# EAGLE design Display_V1_1 (EAGLE 7.7.0)
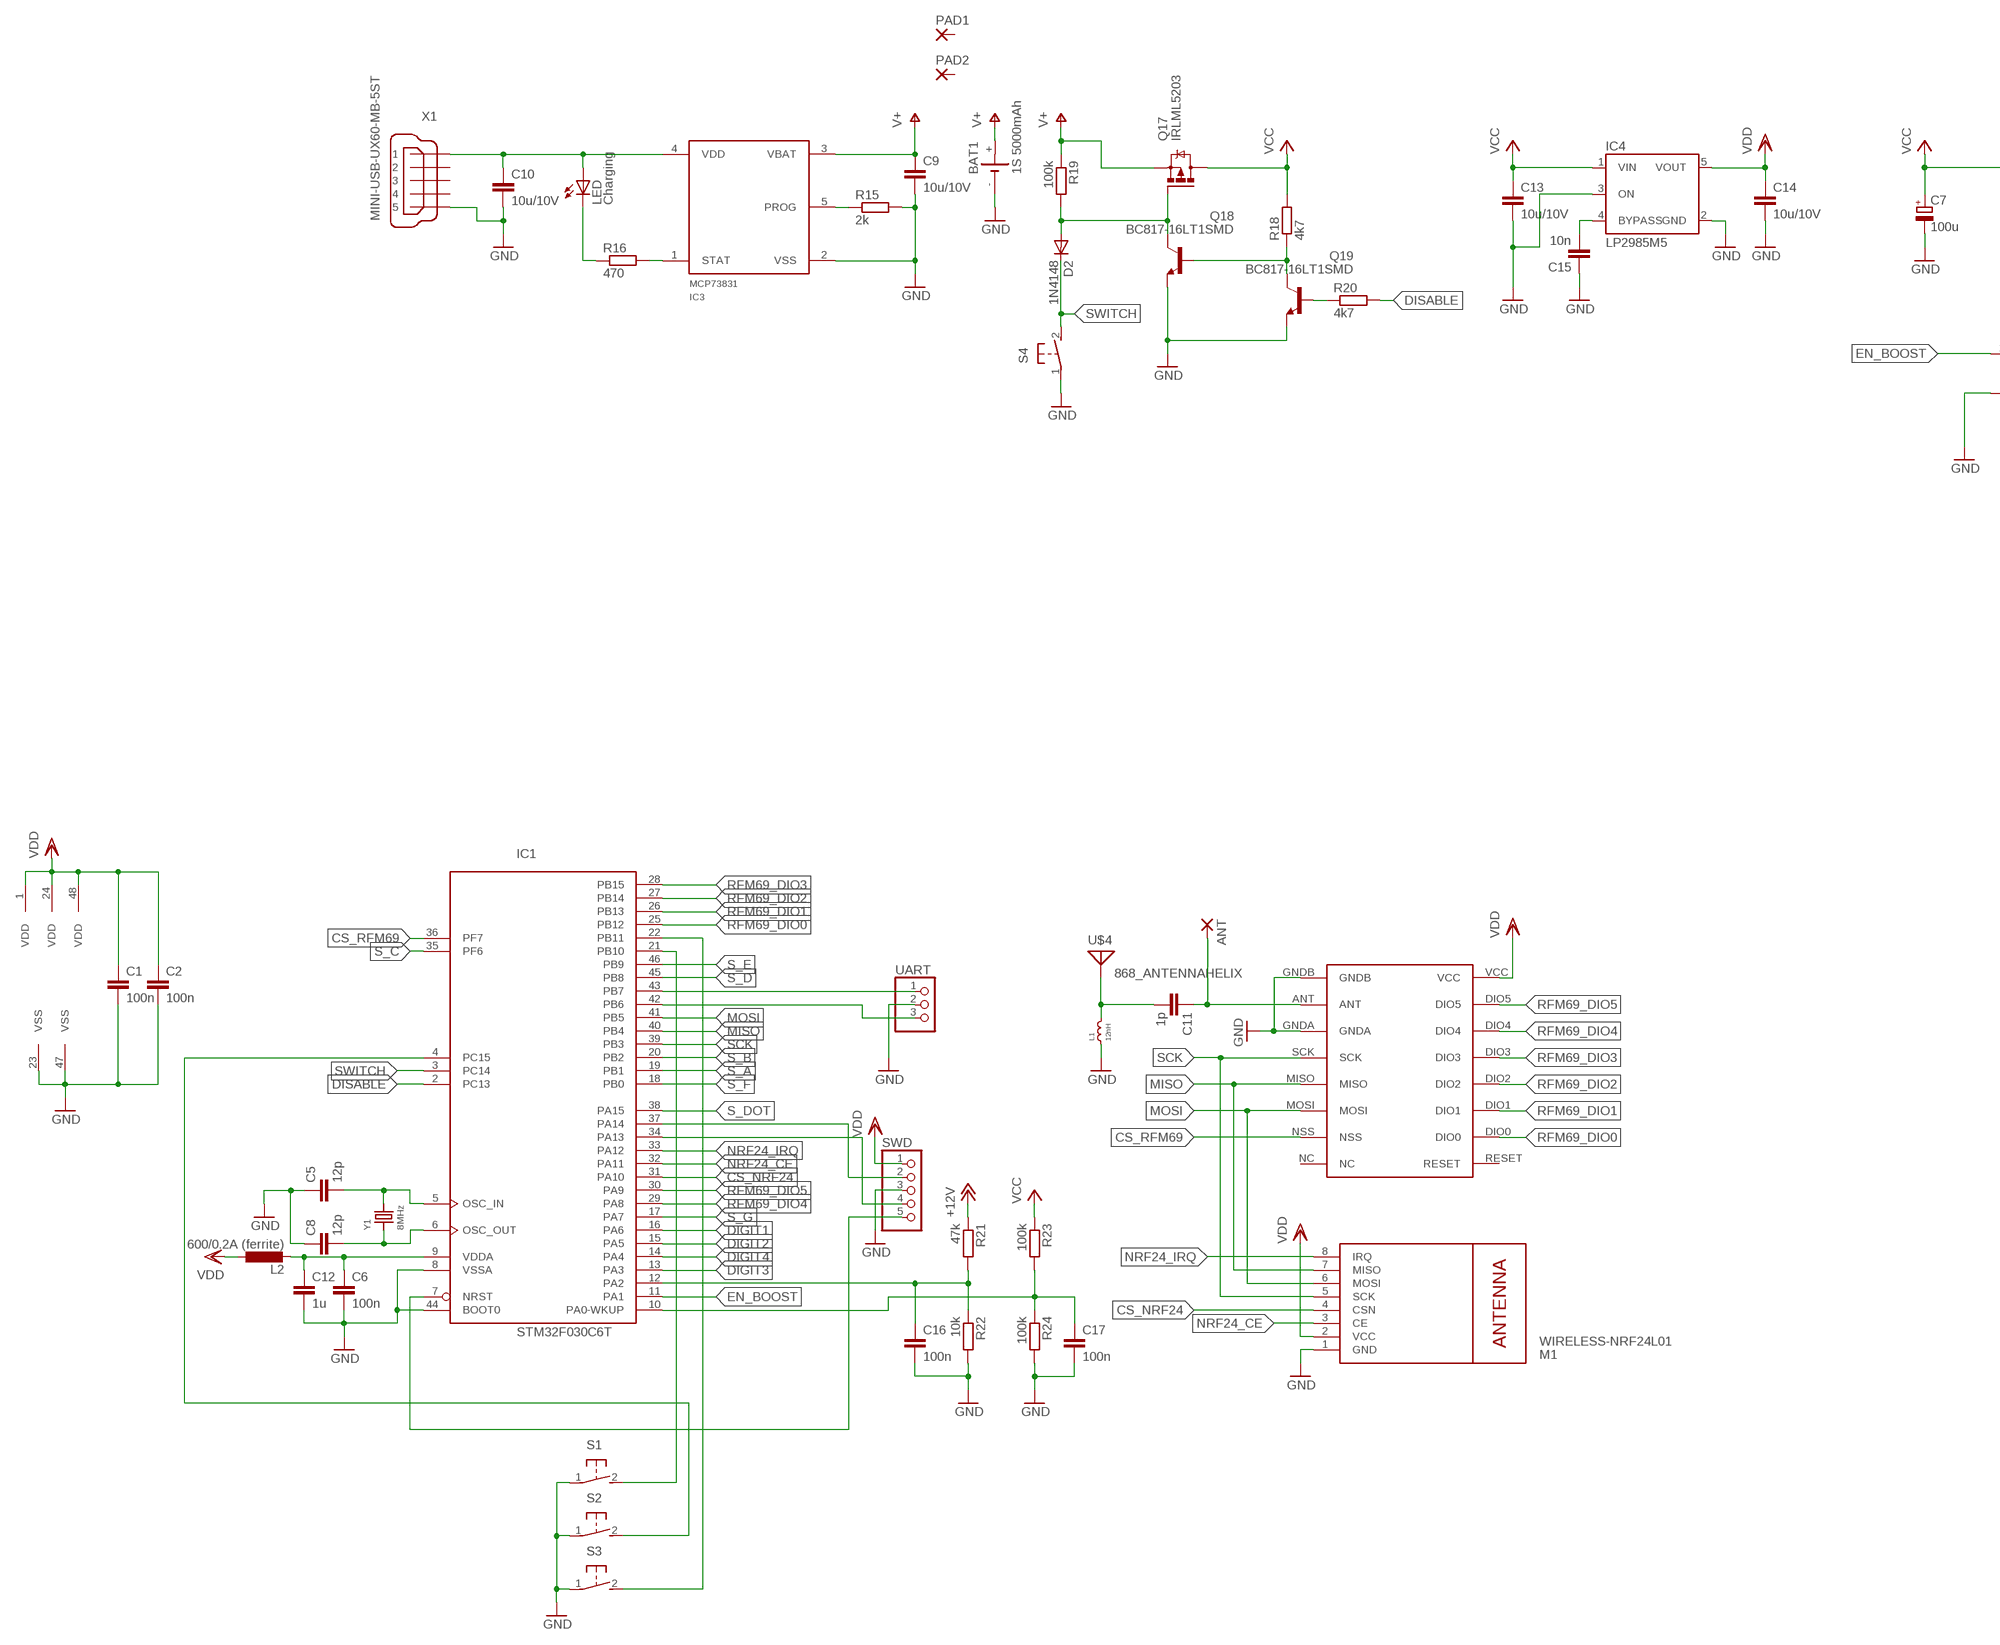
[diagram p0: schematic, sheet 1, part 1 of 2]
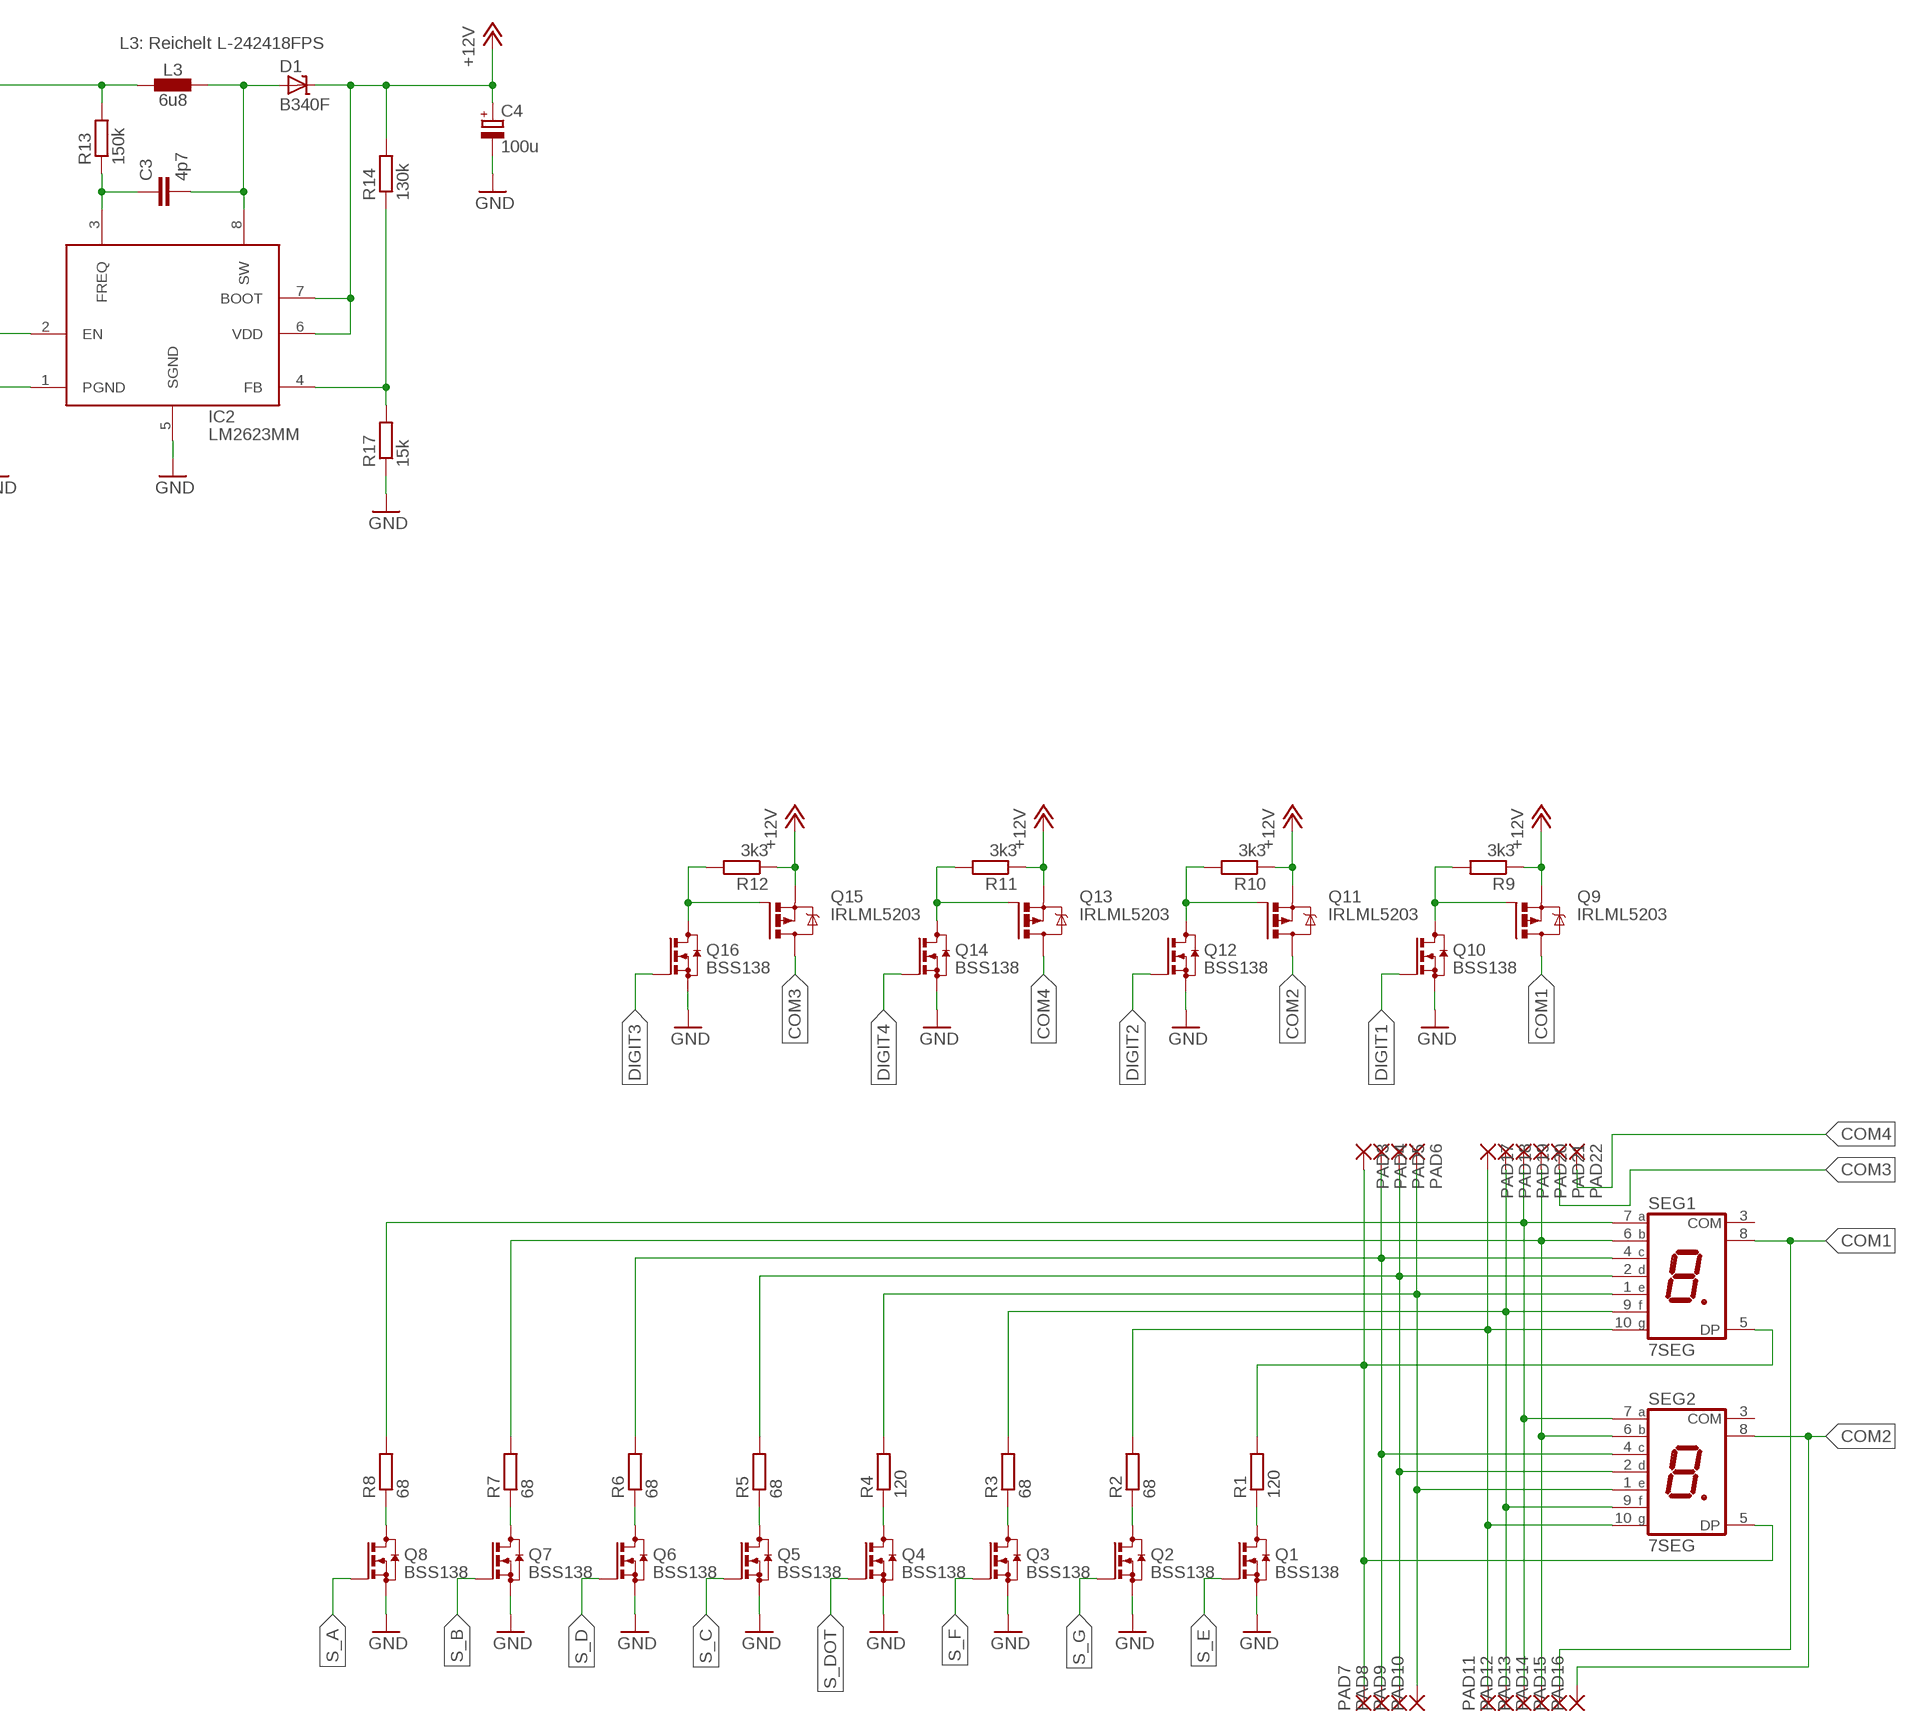
[diagram p1: schematic, sheet 1, part 2 of 2]

## Parts
ANT  1,6/0,8  [1,6/0,8]
BAT1  1S 5000mAh  LIPO  [1S_5000MAH]
C1  100n  C-EUC0603K  [C0603K]
C2  100n  C-EUC0603K  [C0603K]
C3  4p7  C-EUC0603  [C0603]
C4  100u  CPOL-EU153CLV-0605  [153CLV-0605]
C5  12p  C-EUC0603  [C0603]
C6  100n  C-EUC0603  [C0603]
C7  100u  CPOL-EU153CLV-0605  [153CLV-0605]
C8  12p  C-EUC0603  [C0603]
C9  10u/10V  C-EUC1206  [C1206]
C10  10u/10V  C-EUC1206  [C1206]
C11  1p  C-EUC0603  [C0603]
C12  1u  C-EUC0603  [C0603]
C13  10u/10V  C-EUC1206  [C1206]
C14  10u/10V  C-EUC1206  [C1206]
C15  10n  C-EUC0603  [C0603]
C16  100n  C-EUC0603  [C0603]
C17  100n  C-EUC0603  [C0603]
D1  B340F  SD-SMC  [SMC]
D2  1N4148  DIODE-MINIMELF  [MINIMELF]
IC1  STM32F030C6T  [LQFP48]
IC2  LM2623MM  [MSOP08]
IC3  MCP73831  [SOT23-5]
IC4  LP2985M5  [SOT23-5]
L1  12nH  RF-INDUCTOR.0603  [0603]
L2  600/0.2A (ferrite)  L-EUL2012C  [L2012C]
L3  6u8  INDUCTOR-NR60XX  [L_NR60XX]
LED  Charging  LEDCHIPLED_0603  [CHIPLED_0603]
M1  WIRELESS-NRF24L01  [WIRELESS-NRF24L01]
PAD1  2,54/1,0  [2,54/1,0]
PAD2  2,54/1,0  [2,54/1,0]
PAD3  SMD2  [SMD1,27-2,54]
PAD4  SMD2  [SMD1,27-2,54]
PAD5  SMD2  [SMD1,27-2,54]
PAD6  SMD2  [SMD1,27-2,54]
PAD7  SMD2  [SMD1,27-2,54]
PAD8  SMD2  [SMD1,27-2,54]
PAD9  SMD2  [SMD1,27-2,54]
PAD10  SMD2  [SMD1,27-2,54]
PAD11  SMD2  [SMD1,27-2,54]
PAD12  SMD2  [SMD1,27-2,54]
PAD13  SMD2  [SMD1,27-2,54]
PAD14  SMD2  [SMD1,27-2,54]
PAD15  SMD2  [SMD1,27-2,54]
PAD16  SMD2  [SMD1,27-2,54]
PAD17  SMD2  [SMD1,27-2,54]
PAD18  SMD2  [SMD1,27-2,54]
PAD19  SMD2  [SMD1,27-2,54]
PAD20  SMD2  [SMD1,27-2,54]
PAD21  SMD2  [SMD1,27-2,54]
PAD22  SMD2  [SMD1,27-2,54]
Q1  BSS138  BSS123  [SOT23]
Q2  BSS138  BSS123  [SOT23]
Q3  BSS138  BSS123  [SOT23]
Q4  BSS138  BSS123  [SOT23]
Q5  BSS138  BSS123  [SOT23]
Q6  BSS138  BSS123  [SOT23]
Q7  BSS138  BSS123  [SOT23]
Q8  BSS138  BSS123  [SOT23]
Q9  IRLML5203  [MICRO3]
Q10  BSS138  BSS123  [SOT23]
Q11  IRLML5203  [MICRO3]
Q12  BSS138  BSS123  [SOT23]
Q13  IRLML5203  [MICRO3]
Q14  BSS138  BSS123  [SOT23]
Q15  IRLML5203  [MICRO3]
Q16  BSS138  BSS123  [SOT23]
Q17  IRLML5203  [MICRO3]
Q18  BC817-16LT1SMD  [SOT23-BEC]
Q19  BC817-16LT1SMD  [SOT23-BEC]
R1  120  R-EU_R1206  [R1206]
R2  68  R-EU_R1206  [R1206]
R3  68  R-EU_R1206  [R1206]
R4  120  R-EU_R1206  [R1206]
R5  68  R-EU_R1206  [R1206]
R6  68  R-EU_R1206  [R1206]
R7  68  R-EU_R1206  [R1206]
R8  68  R-EU_R1206  [R1206]
R9  3k3  R-EU_R0603  [R0603]
R10  3k3  R-EU_R0603  [R0603]
R11  3k3  R-EU_R0603  [R0603]
R12  3k3  R-EU_R0603  [R0603]
R13  150k  R-EU_R0603  [R0603]
R14  130k  R-EU_R0603  [R0603]
R15  2k  R-EU_R0603  [R0603]
R16  470  R-EU_R0603  [R0603]
R17  15k  R-EU_R0603  [R0603]
R18  4k7  R-EU_R0603  [R0603]
R19  100k  R-EU_R0603  [R0603]
R20  4k7  R-EU_R0603  [R0603]
R21  47k  R-EU_R0603  [R0603]
R22  10k  R-EU_R0603  [R0603]
R23  100k  R-EU_R0603  [R0603]
R24  100k  R-EU_R0603  [R0603]
S1  31-XX  [B3F-31XX]
S2  31-XX  [B3F-31XX]
S3  31-XX  [B3F-31XX]
S4  31-XX  [B3F-31XX]
SEG1  7SEG  [7SEG_70*40]
SEG2  7SEG  [7SEG_70*40]
SWD  PINHD-1X5  [1X05]
U$1  RFM69HW  [RFM]
U$4  868_ANTENNAHELIX  [HELIX_868]
UART  PINHD-1X3  [1X03]
X1  MINI-USB-UX60-MB-5ST  [UX60-MB-5ST]
Y1  8MHz  CRYSTAL.3.2X2.5MM  [3.2X2.5MM]

## Nets
+12V: C4.+ D1.C IC2.6(VDD) IC2.7(BOOT) Q9.2(S) Q11.2(S) Q13.2(S) Q15.2(S) R9.1 R10.1 R11.1 R12.1 R14.2 R21.1
/DISABLE: Q18.B Q19.C R18.1
COM1: PAD15.1(P) Q9.3(D) SEG1.8(COM)
COM2: PAD16.1(P) Q11.3(D) SEG2.8(COM)
COM3: PAD21.1(P) Q15.3(D)
COM4: PAD22.1(P) Q13.3(D)
CS_NRF24: IC1.31(PA10) M1.4(CSN)
CS_RFM69: IC1.36(PF7) U$1.NSS
DIGIT1: IC1.16(PA6) Q10.1(G)
DIGIT2: IC1.15(PA5) Q12.1(G)
DIGIT3: IC1.13(PA3) Q16.1(G)
DIGIT4: IC1.14(PA4) Q14.1(G)
DISABLE: IC1.2(PC13) R20.2
DP: PAD6.1(P) PAD10.1(P) R4.2 SEG1.1(E) SEG2.1(E)
EN_BOOST: IC1.11(PA1) IC2.2(EN)
GND: BAT1.- C1.2 C2.2 C4.- C5.1 C6.2 C7.- C8.1 C9.2 C10.2 C12.2 C13.2 C14.2 C15.1 C16.2 C17.2 IC1.8(VSSA) IC1.23(VSS) IC1.44(BOOT0) IC1.47(VSS) IC2.1(PGND) IC2.5(SGND) IC3.2(VSS) IC4.2(GND) IC4.3(ON) L1.1 M1.1(GND) Q1.2(S) Q2.2(S) Q3.2(S) Q4.2(S) Q5.2(S) Q6.2(S) Q7.2(S) Q8.2(S) Q10.2(S) Q12.2(S) Q14.2(S) Q16.2(S) Q18.E Q19.E R15.2 R17.1 R22.2 R24.2 S1.1(P) S2.1(P) S3.1(P) S4.1(P) SWD.3 U$1.GNDA U$1.GNDB UART.2 X1.5
MISO: IC1.40(PB4) M1.7(MISO) U$1.MISO
MOSI: IC1.41(PB5) M1.6(MOSI) U$1.MOSI
N$1: Q1.3(D) R1.1
N$2: Q2.3(D) R2.1
N$3: Q3.3(D) R3.1
N$4: Q4.3(D) R4.1
N$5: Q5.3(D) R5.1
N$6: Q6.3(D) R6.1
N$7: Q7.3(D) R7.1
N$8: Q8.3(D) R8.1
N$9: Q9.1(G) Q10.3(D) R9.2
N$10: Q11.1(G) Q12.3(D) R10.2
N$11: Q13.1(G) Q14.3(D) R11.2
N$12: Q15.1(G) Q16.3(D) R12.2
N$13: IC1.21(PB10) S1.2(S)
N$14: C3.1 IC2.3(FREQ) R13.1
N$15: C5.2 IC1.5(OSC_IN) Y1.3
N$17: IC1.4(PC15) S2.2(S)
N$18: IC1.22(PB11) S3.2(S)
N$19: C8.2 IC1.6(OSC_OUT) Y1.1
N$20: IC3.5(PROG) R15.1
N$21: IC3.1(STAT) R16.2
N$22: LED.C R16.1
N$23: C3.2 D1.A IC2.8(SW) L3.2
N$24: ANT.1(P) C11.1 U$1.ANT
N$25: C11.2 L1.2 U$4.ANT U$4.P$2 U$4.P$3 U$4.P$4 U$4.P$5 U$4.P$6 U$4.P$7 U$4.P$8 U$4.P$9 U$4.P$10 U$4.P$11 U$4.P$12 U$4.P$13 U$4.P$14 U$4.P$15 U$4.P$16 U$4.P$17 U$4.P$18 U$4.P$19 U$4.P$20
N$26: IC2.4(FB) R14.1 R17.2
N$27: D2.A Q17.1(G) Q18.C R19.2
N$28: Q19.B R20.1
N$29: C16.1 IC1.12(PA2) R21.2 R22.1
N$30: C15.2 IC4.4(BYPASS)
N$31: C17.1 IC1.10(PA0-WKUP) R23.2 R24.1
NRF24_CE: IC1.32(PA11) M1.3(CE)
NRF24_IRQ: IC1.33(PA12) M1.8(IRQ)
NRST: IC1.7(NRST) SWD.5
RFM69_DIO0: IC1.25(PB12) U$1.DIO0
RFM69_DIO1: IC1.26(PB13) U$1.DIO1
RFM69_DIO2: IC1.27(PB14) U$1.DIO2
RFM69_DIO3: IC1.28(PB15) U$1.DIO3
RFM69_DIO4: IC1.29(PA8) U$1.DIO4
RFM69_DIO5: IC1.30(PA9) U$1.DIO5
RX: IC1.43(PB7) UART.1
S_A: IC1.19(PB1) Q8.1(G)
S_B: IC1.20(PB2) Q7.1(G)
S_C: IC1.35(PF6) Q5.1(G)
S_D: IC1.45(PB8) Q6.1(G)
S_DOT: IC1.38(PA15) Q4.1(G)
S_E: IC1.46(PB9) Q1.1(G)
S_F: IC1.18(PB0) Q3.1(G)
S_G: IC1.17(PA7) Q2.1(G)
SCK: IC1.39(PB3) M1.5(SCK) U$1.SCK
SEG_A: PAD13.1(P) PAD19.1(P) R8.2 SEG1.7(A) SEG2.7(A)
SEG_B: PAD14.1(P) PAD20.1(P) R7.2 SEG1.6(B) SEG2.6(B)
SEG_C: PAD5.1(P) PAD9.1(P) R5.2 SEG1.2(D) SEG2.2(D)
SEG_D: PAD4.1(P) PAD8.1(P) R6.2 SEG1.4(C) SEG2.4(C)
SEG_E: PAD3.1(P) PAD7.1(P) R1.2 SEG1.5(DP) SEG2.5(DP)
SEG_F: PAD12.1(P) PAD18.1(P) R3.2 SEG1.9(F) SEG2.9(F)
SEG_G: PAD11.1(P) PAD17.1(P) R2.2 SEG1.10(G) SEG2.10(G)
SWCLK: IC1.37(PA14) SWD.2
SWDIO: IC1.34(PA13) SWD.4
SWITCH: D2.C IC1.3(PC14) S4.2(S)
TX: IC1.42(PB6) UART.3
V+: BAT1.+ C9.1 IC3.3(VBAT) Q17.2(S) R19.1
VCC: C7.+ C13.1 IC4.1(VIN) L3.1 Q17.3(D) R13.2 R18.2 R23.1
VDD: C1.1 C2.1 C14.1 IC1.1(VDD) IC1.24(VDD) IC1.48(VDD) IC4.5(VOUT) L2.1 M1.2(VCC) SWD.1 U$1.VCC
VDDA: C6.1 C12.1 IC1.9(VDDA) L2.2
VIN: C10.1 IC3.4(VDD) LED.A X1.1
Unconnected: PAD1.1(P) PAD2.1(P) SEG1.3(COM) SEG2.3(COM) U$1.NC U$1.RESET X1.2 X1.3 X1.4

## Notes on the sheet
- L3: Reichelt L-242418FPS

## Library data of the parts
ANT = wirepad:1,6/0,8: THROUGH-HOLE PAD
BAT1 = battery_custom:LIPO
C1-C3 C5 C6 C8-C17 = rcl:C-EU: CAPACITOR, European symbol
C4 C7 = resistor:CPOL-EU: POLARIZED CAPACITOR, European symbol
D1 = diodes:SD-: Schottky diode
D2 = diode:DIODE-: DIODE
IC1 = micro-stm_v3:STM32F030C*T: ARM 32-bit Cortex™-M0 CPU 48 MHz maximum frequency 32 to 64 Kbytes of Flash memory 4 to 8 kbytes of SRAM 39 GPIOs 2.4 to 3.6 V application supply
IC2 = v-reg-3:LM2623
IC3 = mcp:MCP73831
IC4 = v-reg-3:LP2985: National Semiconductor <http://www.national.com> Micropower Linear Regulator 150mA regulated output, Vin 16V max., ultra-low dropout of 300mV @ 150mA, 1µA standby current, low noise
L1 = standardparts:RF-INDUCTOR
L2 = rcl:L-EU: INDUCTOR, European symbol
L3 = we-power:INDUCTOR: Power Inductors Taiyo Yuden NR6028 NR6028T0R9N - 0.9uH, Ir=6.6A NR6028T1R5N - 1.5uH, Ir=5.0A NR6028T2R2N - 2.2uH, Ir=4.2A NR6028T3R0N - 3.0uH, Ir=3.6A NR6028T4R7M - 4.7uH, Ir=2.7A NR6028T6R0M - 6.0uH, Ir=2.5A NR6028T100M - 10uH, Ir=1.9A NR6028T150M - 15uH, Ir=1.6A NR6028T220M - 22uH, Ir=1.3A NR6028T330M - 33uH, Ir=1.1A NR6028T470M - 47uH, Ir=0.95A NR6028T680M - 68uH, Ir=0.76A NR6028T101M - 100uH, Ir=0.62A Taiyo Yuden NR6045 NR6045T1R0N - 1.0uH, Ir=8.5A NR6045T1R3N - 1.3uH, Ir=8.0A NR6045T1R8N - 1.8uH, Ir=7.0A NR6045T2R3N - 2.3uH, Ir=6.0A NR6045T3R0N - 3.0uH, Ir=5.0A NR6045T4R5M - 4.5uH, Ir=4.0A NR6045T6R3M - 6.3uH, Ir=3.8A NR6045T100M - 10uH, Ir=3.0A NR6045T150M - 15uH, Ir=2.3A NR6045T220M - 22uH, Ir=1.9A NR6045T330M - 33uH, Ir=1.5A NR6045T470M - 47uH, Ir=1.3A NR6045T680M - 68uH, Ir=1.0A NR6045T101M - 100uH, Ir=0.8A
LED = led:LED: LED OSRAM: - CHIPLED LG R971, LG N971, LY N971, LG Q971, LY Q971, LO R971, LY R971 LH N974, LH R974 LS Q976, LO Q976, LY Q976 LO Q996 - Hyper CHIPLED LW Q18S LB Q993, LB Q99A, LB R99A - SideLED LS A670, LO A670, LY A670, LG A670, LP A670 LB A673, LV A673, LT A673, LW A673 LH A674 LY A675 LS A676, LA A676, LO A676, LY A676, LW A676 LS A679, LY A679, LG A679 - Hyper Micro SIDELED® LS Y876, LA Y876, LO Y876, LY Y876 LT Y87S - SmartLED LW L88C, LW L88S LB L89C, LB L89S, LG L890 LS L89K, LO L89K, LY L89K LS L896, LA L896, LO L896, LY L896 - TOPLED LS T670, LO T670, LY T670, LG T670, LP T670 LSG T670, LSP T670, LSY T670, LOP T670, LYG T670 LG T671, LOG T671, LSG T671 LB T673, LV T673, LT T673, LW T673 LH T674 LS T676, LA T676, LO T676, LY T676, LB T676, LH T676, LSB T676, LW T676 LB T67C, LV T67C, LT T67C, LS T67K, LO T67K, LY T67K, LW E67C LS E67B, LA E67B, LO E67B, LY E67B, LB E67C, LV E67C, LT E67C LW T67C LS T679, LY T679, LG T679 LS T770, LO T770, LY T770, LG T770, LP T770 LB T773, LV T773, LT T773, LW T773 LH T774 LS E675, LA E675, LY E675, LS T675 LS T776, LA T776, LO T776, LY T776, LB T776 LHGB T686 LT T68C, LB T68C - Hyper Mini TOPLED® LB M676 - Mini TOPLED Santana® LG M470 LS M47K, LO M47K, LY M47K Source: http://www.osram.convergy.de LUXEON: - LUMILED® LXK2-PW12-R00, LXK2-PW12-S00, LXK2-PW14-U00, LXK2-PW14-V00 LXK2-PM12-R00, LXK2-PM12-S00, LXK2-PM14-U00 LXK2-PE12-Q00, LXK2-PE12-R00, LXK2-PE12-S00, LXK2-PE14-T00, LXK2-PE14-U00 LXK2-PB12-K00, LXK2-PB12-L00, LXK2-PB12-M00, LXK2-PB14-N00, LXK2-PB14-P00, LXK2-PB14-Q00 LXK2-PR12-L00, LXK2-PR12-M00, LXK2-PR14-Q00, LXK2-PR14-R00 LXK2-PD12-Q00, LXK2-PD12-R00, LXK2-PD12-S00 LXK2-PH12-R00, LXK2-PH12-S00 LXK2-PL12-P00, LXK2-PL12-Q00, LXK2-PL12-R00 Source: www.luxeon.com KINGBRIGHT: KA-3528ASYC Source: www.kingbright.com
M1 = diy-modules:WIRELESS-NRF24L01: 2.4 GHz Wireless Module based on NRF24L01 chip More details available here: http://www.electrodragon.com/w/NRF24L01 Click here to find device on ebay.com <http://www.ebay.com/sch/nrf24l01+arduino>
PAD1 PAD2 = wirepad:2,54/1,0: THROUGH-HOLE PAD
PAD3-PAD22 = wirepad:SMD2: SMD PAD
Q1-Q8 Q10 Q12 Q14 Q16 = transistor-small-signal:BSS123: N-CHANNEL MOS FET
Q9 Q11 Q13 Q15 Q17 = transistor-power:IRLML5203: HEXFET P-Channel Power MOSFET
Q18 Q19 = transistor-npn:BC817*: NPN Transistor
R1-R8 R13-R24 = rcl:R-EU_: RESISTOR, European symbol
R9-R12 = resistor:R-EU_: RESISTOR, European symbol
S1-S4 = switch-omron:31-XX: OMRON SWITCH; MPN: B3F-3100; OC_FARNELL: 959704; OC_NEWARK: 36M3582
SEG1 SEG2 = display-custom:7SEG
SWD = pinhead:PINHD-1X5: PIN HEADER
U$1 = hoperf:RFM69HW
U$4 = antenna:868_ANTENNA
UART = pinhead:PINHD-1X3: PIN HEADER
X1 = con-hirose:MINI-USB-: MINI USB Connector Source: http://www.hirose.co.jp/cataloge_hp/e24000019.pdf; OC_FARNELL: unknown; OC_NEWARK: unknown
Y1 = abracon:CRYSTAL

## Board
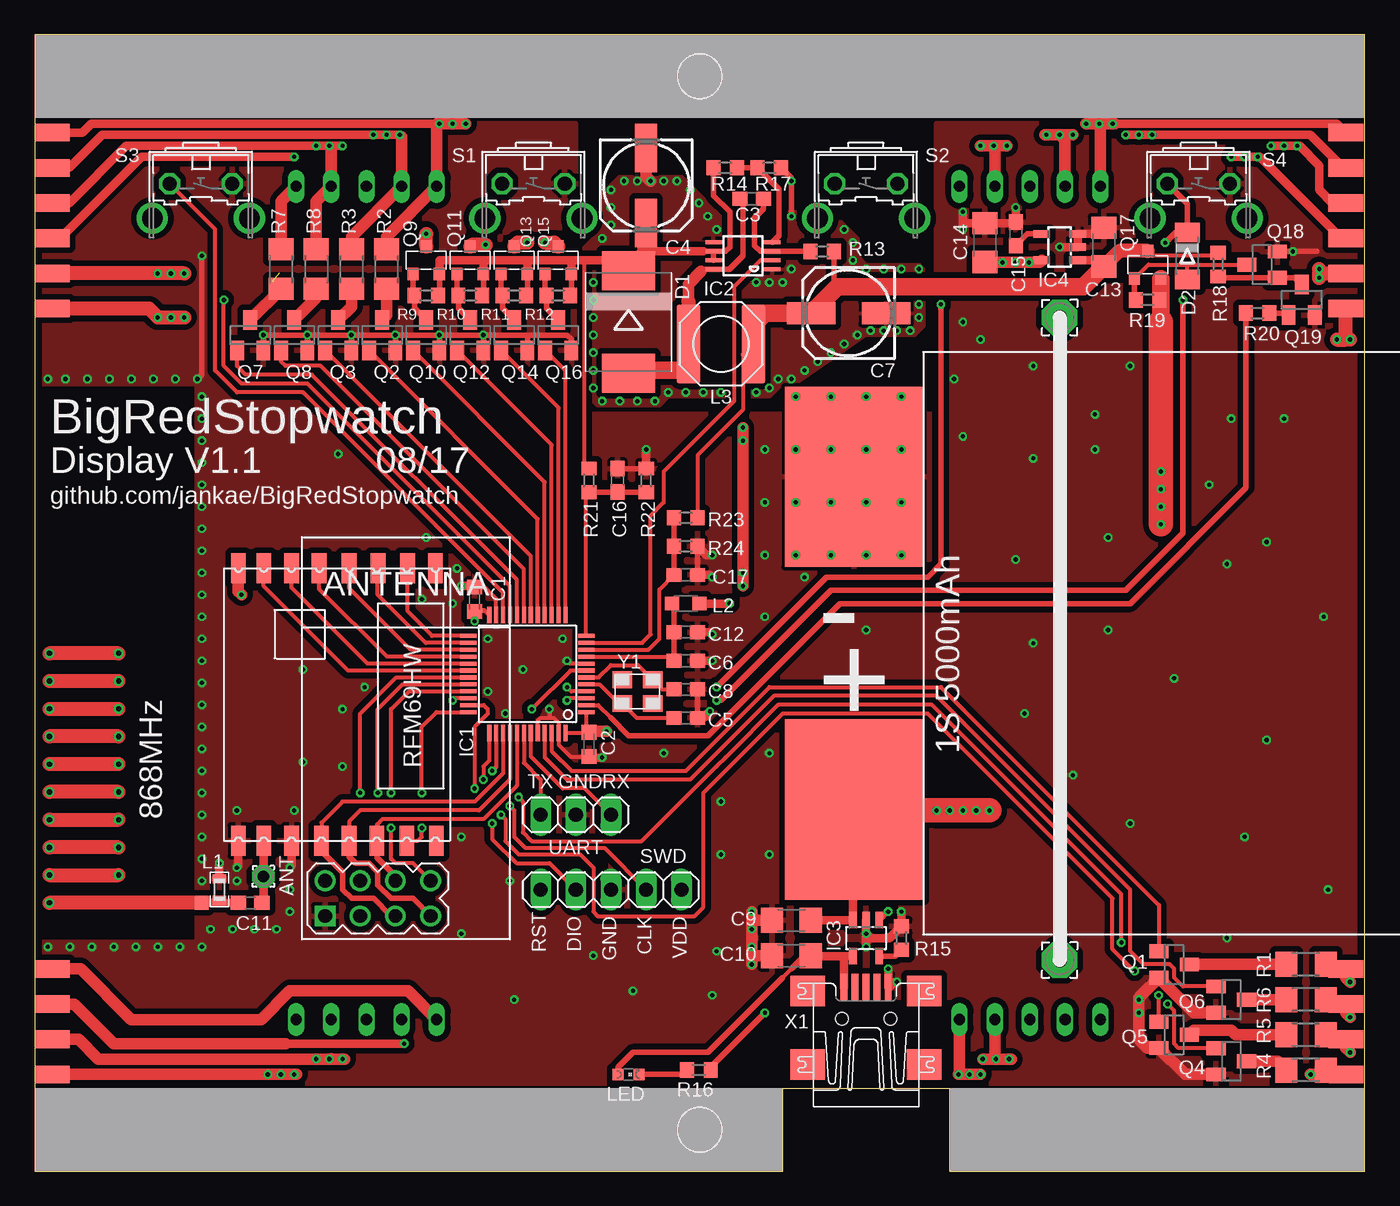
[diagram p2: board, top side]
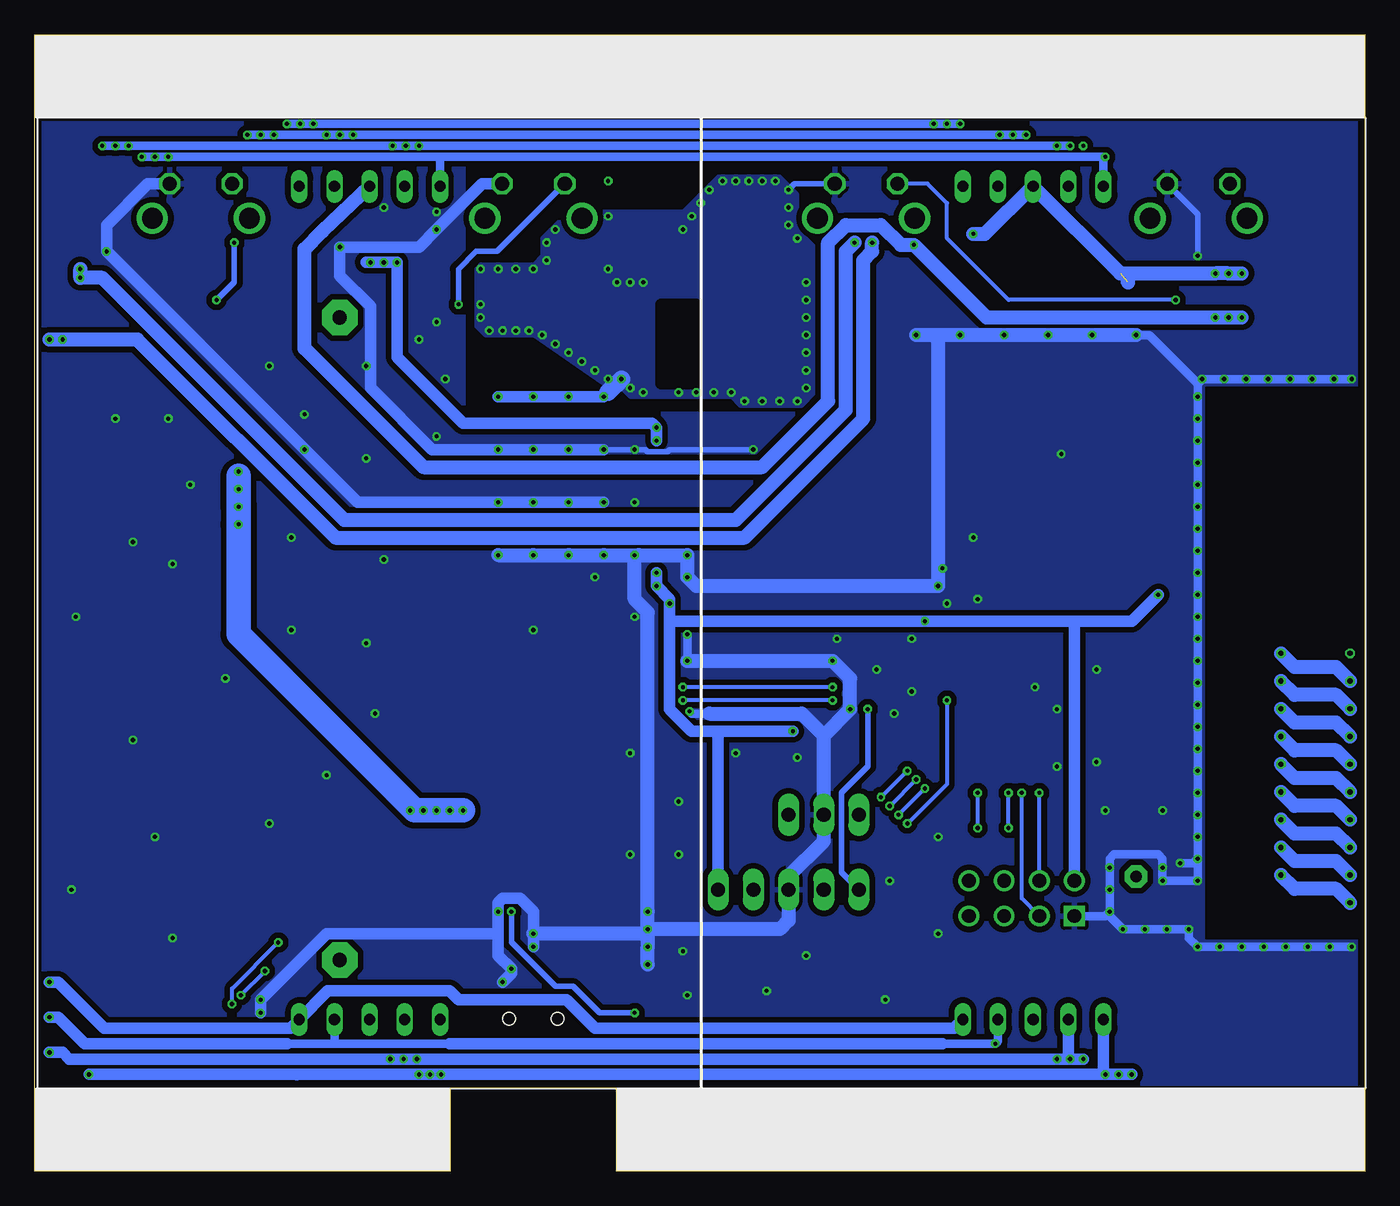
[diagram p3: board, bottom side, seen from below]

Size 96 x 82 mm. Coordinates in mm from the lower left corner, seen from the top.
Outline: 0,0 54,0 54,6 66,6 66,0 96,0 96,82 0,82 0,0
Copper layers (1*16): Top 0.035mm / dielectric 1.6mm / Bottom 0.035mm
Design rules "Elecrow_2-layer_PCB_eagle_rule": minimum track width 6mil, minimum drill 12mil, track to track 6mil, track to pad 6mil, pad to pad 6mil, via to via 8mil, smd to smd 0mil, copper to edge 20mil, drill to drill 10mil, minimum pad ring 6mil, minimum via ring 6mil, stop-mask expansion 0mil, vias tented up to drill 100mil, thermal gap 10mil
Holes 3.2 mm at 48,79 48,3
tKeepout: area 0,76 to 96,82; area 0,0 to 54,6; area 66,0 to 96,6
bKeepout: area 0,76 to 96,82; area 0,0 to 54,6; area 66,0 to 96,6
tRestrict: area 48.3,56.8 to 50.2,62.5
bRestrict: area 48.3,56.8 to 50.8,62.5

### Footprints (pad centres in the part's own frame; a part is rotated, then mirrored left to right if it is on the bottom)
1,6/0,8 = drill 0.813 pad 1.6 octagon: 1 0,0
1S_5000MAH = smd 10 x 13: + -5,-12; - -5,12
C0603K = smd 1.05 x 1.08: 1 -0.875,0; 2 0.875,0
C0603 = smd 1.1 x 1: 1 -0.85,0; 2 0.85,0
153CLV-0605 = smd 3.5 x 1.6: + 2.7,0; - -2.7,0
C1206 = smd 1.6 x 1.8: 1 -1.4,0; 2 1.4,0
SMC = smd 2.8 x 3.8: A 3.7,0; C -3.7,0
MINIMELF = smd 1.4 x 1.8: A 1.7,0; C -1.7,0
LQFP48 = smd 0.3 x 1.2: 1 -2.75,-4.25; 2 -2.25,-4.25; 3 -1.75,-4.25; 4 -1.25,-4.25; 5 -0.75,-4.25; 6 -0.25,-4.25; 7 0.25,-4.25; 8 0.75,-4.25; 9 1.25,-4.25; 10 1.75,-4.25; 11 2.25,-4.25; 12 2.75,-4.25; 25 2.75,4.25; 26 2.25,4.25; 27 1.75,4.25; 28 1.25,4.25; 29 0.75,4.25; 30 0.25,4.25; 31 -0.25,4.25; 32 -0.75,4.25; 33 -1.25,4.25; 34 -1.75,4.25; 35 -2.25,4.25; 36 -2.75,4.25 | smd 1.2 x 0.3: 13 4.25,-2.75; 14 4.25,-2.25; 15 4.25,-1.75; 16 4.25,-1.25; 17 4.25,-0.75; 18 4.25,-0.25; 19 4.25,0.25; 20 4.25,0.75; 21 4.25,1.25; 22 4.25,1.75; 23 4.25,2.25; 24 4.25,2.75; 37 -4.25,2.75; 38 -4.25,2.25; 39 -4.25,1.75; 40 -4.25,1.25; 41 -4.25,0.75; 42 -4.25,0.25; 43 -4.25,-0.25; 44 -4.25,-0.75; 45 -4.25,-1.25; 46 -4.25,-1.75; 47 -4.25,-2.25; 48 -4.25,-2.75
MSOP08 = smd 0.3 x 1.2: 1 -0.976,-2.113; 2 -0.326,-2.113; 3 0.324,-2.113; 4 0.974,-2.113; 5 0.974,2.112; 6 0.324,2.112; 7 -0.326,2.112; 8 -0.976,2.112
SOT23-5 = smd 0.55 x 1.2: 1 -0.95,-1.3; 2 0,-1.3; 3 0.95,-1.3; 4 0.95,1.3; 5 -0.95,1.3
0603 = smd 0.65 x 1: 1 -0.775,0; 2 0.775,0
L2012C = smd 1 x 1: 1 -1,0; 2 1,0
L_NR60XX = smd 5.7 x 1.7: 1 0,2.35; 2 0,-2.35
CHIPLED_0603 = smd 0.8 x 0.8: A 0,-0.75; C 0,0.75
WIRELESS-NRF24L01 = drill 1 square: 1 -12.7,6.35 | drill 1: 2 -10.16,6.35; 3 -12.7,3.81; 4 -10.16,3.81; 5 -12.7,1.27; 6 -10.16,1.27; 7 -12.7,-1.27; 8 -10.16,-1.27
2,54/1,0 = drill 1.016 pad 2.54 octagon: 1 0,0
SMD1,27-2,54 = smd 1.27 x 2.54: 1 0,0
SOT23 = smd 1 x 1.4: 1 -0.95,-1.1; 2 0.95,-1.1; 3 0,1.1
MICRO3 = smd 0.8 x 0.9: 1 -0.95,-1; 2 0.95,-1; 3 0,1
SOT23-BEC = smd 1 x 1.4: B -0.95,-1.1; C 0,1.1; E 0.95,-1.1
R1206 = smd 1.6 x 1.803: 1 -1.422,0; 2 1.422,0
R0603 = smd 1 x 1.1: 1 -0.85,0; 2 0.85,0
B3F-31XX = drill 1.016 octagon: 1 -2.261,-1.245; 2 2.261,-1.245 | drill 1.499 pad 2.159: 3 -3.505,1.245; 4 3.505,1.245
7SEG_70*40 = drill 0.8 long: 1 5.08,-30.05; 2 2.54,-30.05; 3 0,-30.05; 4 -2.54,-30.05; 5 -5.08,-30.05; 6 5.08,30.05; 7 2.54,30.05; 8 0,30.05; 9 -2.54,30.05; 10 -5.08,30.05
1X05 = drill 1.016 long: 1 -5.08,0; 2 -2.54,0; 3 0,0; 4 2.54,0; 5 5.08,0
RFM = smd 2.184 x 1.067: ANT 19.651,2.889; DIO0 0,13.27; DIO1 0,11.143; DIO2 0,9.047; DIO3 0,6.889; DIO4 0,4.889; DIO5 0,2.889; GNDA 19.651,4.889; GNDB 19.651,1.048; MISO 19.651,9.047; MOSI 19.651,11.047; NC 19.651,15.334; NSS 19.651,13.206; RESET 0,15.27; SCK 19.651,7.048; VCC 0,1.048
HELIX_868 = smd 1 x 1: ANT 0,0 | drill 0.38 octagon: P$2 0,11; P$3 2,11; P$4 4,11; P$5 6,11; P$6 8,11; P$7 10,11; P$8 12,11; P$9 14,11; P$10 16,11; P$11 18,11; P$12 18,6; P$13 16,6; P$14 14,6; P$15 12,6; P$16 10,6; P$17 8,6; P$18 6,6; P$19 4,6; P$20 2,6
1X03 = drill 1.016 long: 1 -2.54,0; 2 0,0; 3 2.54,0
UX60-MB-5ST = smd 2 x 0.5: 1 2.25,1.6; 2 2.25,0.8; 3 2.25,0; 4 2.25,-0.8; 5 2.25,-1.6 | smd 2.2 x 2.5: M1 -3.3,-4.2; M2 -3.3,4.2; M3 2,4.2; M4 2,-4.2 | hole 0.9: 0,-1.75; 0,1.75
3.2X2.5MM = smd 1.4 x 1.2: 1 -1.1,-0.85; 2 1.1,-0.85; 3 1.1,0.85; 4 -1.1,0.85

### Placement (x,y rotation side)
ANT  16.51,21.27 0 top
BAT1  64.14,38.1 0 top
C1  31.75,41.27 90 top
C2  40.01,30.8 270 top
C3  51.75,70.17 180 top
C4  44.13,71.12 270 top
C5  46.99,32.7 180 top
C6  46.99,36.83 0 top
C7  58.74,61.91 180 top
C8  46.99,34.77 180 top
C9  54.61,18.1 180 top
C10  54.61,15.56 180 top
C11  15.56,19.37 180 top
C12  46.99,38.89 0 top
C13  77.15,66.67 90 top
C14  68.58,66.99 90 top
C15  70.8,67.63 270 top
C16  42.07,49.85 90 top
C17  46.99,43.02 0 top
D1  42.86,61.28 270 top
D2  83.19,66.04 270 top
IC1  35.56,35.88 90 top
IC2  51.12,66.04 90 top
IC3  60.01,16.83 180 top
IC4  73.98,66.67 90 top
L1  13.34,20.32 270 top
L2  46.99,40.96 180 top
L3  49.53,59.69 270 top
LED  42.86,6.99 270 top
M1  27.3,31.11 90 top
PAD1  73.98,15.24 0 top
PAD2  73.98,61.59 0 top
PAD3  1.27,14.61 90 top
PAD4  1.27,12.06 90 top
PAD5  1.27,9.53 90 top
PAD6  1.27,6.99 90 top
PAD7  94.61,14.61 90 top
PAD8  94.61,12.06 90 top
PAD9  94.61,9.53 90 top
PAD10  94.61,6.99 90 top
PAD11  1.27,74.93 90 top
PAD12  1.27,72.39 90 top
PAD13  1.27,69.85 90 top
PAD14  1.27,67.31 90 top
PAD15  1.27,64.77 90 top
PAD16  1.27,62.23 90 top
PAD17  94.61,74.93 90 top
PAD18  94.61,72.39 90 top
PAD19  94.61,69.85 90 top
PAD20  94.61,67.31 90 top
PAD21  94.61,64.77 90 top
PAD22  94.61,62.23 90 top
Q1  82.23,14.92 270 top
Q2  25.08,60.33 0 top
Q3  21.91,60.33 0 top
Q4  86.36,7.94 270 top
Q5  82.23,9.84 270 top
Q6  86.36,12.38 270 top
Q7  15.56,60.33 0 top
Q8  18.73,60.33 0 top
Q9  28.26,65.72 0 top
Q10  28.26,60.33 0 top
Q11  31.43,65.72 0 top
Q12  31.43,60.33 0 top
Q13  34.61,65.72 0 top
Q14  34.61,60.33 0 top
Q15  37.78,65.72 0 top
Q16  37.78,60.33 0 top
Q17  80.33,65.41 0 top
Q18  88.58,65.41 90 top
Q19  91.44,62.87 0 top
R1  91.76,14.92 0 top
R2  25.4,65.09 90 top
R3  22.86,65.09 90 top
R4  91.76,7.3 0 top
R5  91.76,9.84 0 top
R6  91.76,12.38 0 top
R7  17.78,65.09 90 top
R8  20.32,65.09 90 top
R9  28.26,63.18 180 top
R10  31.43,63.18 180 top
R11  34.61,63.18 180 top
R12  37.78,63.18 180 top
R13  56.83,66.36 0 top
R14  49.85,72.39 180 top
R15  62.55,16.83 90 top
R16  47.94,7.3 0 top
R17  53.02,72.39 180 top
R18  85.41,65.41 90 top
R19  80.33,62.87 180 top
R20  88.27,61.91 180 top
R21  40.01,49.85 270 top
R22  44.13,49.85 90 top
R23  46.99,47.15 180 top
R24  46.99,45.09 0 top
S1  36,70 180 top
S2  60,70 180 top
S3  12,70 180 top
S4  84,70 180 top
SEG1  23.94,41 0 bottom
SEG2  71.83,41 0 bottom
SWD  41.59,20.32 180 top
U$1  13.65,43.5 270 top
U$4  12.06,19.37 90 top
UART  39.05,25.72 180 top
X1  60,11 90 top
Y1  43.5,34.61 180 top

### Tracks (layer width: path | path; a pad name or v marks a point on that pad's centre or on a via)
+12V
  Top 0.305: R21.1 39.69,51.02 39.69,65.72
  Top 0.406: Q9.2 29.21,63.28 R9.1 | Q11.2 32.38,63.28 R10.1 | Q13.2 35.56,63.28 R11.1 | Q15.2 38.73,63.28 R12.1 | R14.2 49,70.38 50.16,69.22 50.16,66.67 49.85,66.36 IC2.6 | IC2.7 IC2.6 | 48.26,66.36 IC2.6
  Top 0.61: Q9.2 29.21,65.72 32.38,65.72 | 32.38,65.72 35.56,65.72 | 35.56,65.72 38.73,65.72 | 38.73,65.72 39.69,65.72 42.12,65.72 D1.C | Q11.2 32.38,65.72 | Q13.2 35.56,65.72 | Q15.2 38.73,65.72 | 44.45,66.67 44.13,66.99 | 48.26,66.36 44.13,66.36
  Top 1.27: C4.+ 44.13,66.99 44.13,66.36 44.13,66.25 D1.C
/DISABLE
  Top 0.406: Q18.B | Q18.B 85.51,64.45 R18.1 | Q18.B 90.95,64.45 Q19.C
COM1  (via drill 0.3)  (1 unrouted)
  Top 1.016: Q9.3 v28.26,67.63 | v10.79,64.77 PAD15.1
  Bottom 1.016: v28.26,67.63 27.42,67.63 SEG1.8 17.66,64.77 v10.79,64.77 v9.84,64.77 v8.89,64.77 | 17.14,64.19 17.09,64.14
COM2  (via drill 0.3)
  Top 1.016: v32.54,66.83 31.54,66.83 Q11.3 | PAD16.1 8.26,62.23 v8.89,61.59 v10.79,61.59
  Bottom 1.016: SEG2.8 75.25,67.8 76.52,66.53 76.52,59.37 67.94,50.8 43.5,50.8 38.73,55.56 38.73,66.99 37.47,68.26 34.92,68.26 33.5,66.83 v32.54,66.83 27.3,61.59 v10.79,61.59 v9.84,61.59 v8.89,61.59
COM3  (via drill 0.3)
  Top 1.016: v36.83,66.99 37.51,66.99 Q15.3 | v92.71,65.09 92.71,64.77 | v92.71,64.45 92.71,64.77 | 92.71,64.77 PAD21.1
  Bottom 1.016: v36.83,66.99 37.47,66.36 37.47,54.93 45.4,46.99 73.66,46.99 91.12,64.45 v92.71,64.45 v92.71,65.09
COM4  (via drill 0.3)
  Top 1.016: v35.56,66.99 34.88,66.99 Q13.3 | v94.93,60.01 94.61,60.01 | v93.98,60.01 94.61,60.01 | 94.61,60.01 PAD22.1
  Bottom 1.016: v35.56,66.99 35.56,66.36 36.2,65.72 36.2,54.29 44.77,45.72 74.3,45.72 88.58,60.01 v94.93,60.01
CS_NRF24  (via drill 0.3)
  Top 0.305: v23.5,27.3 23.5,33.02 26.1,35.63 IC1.31
  Bottom 0.305: M1.4 v23.5,27.3
CS_RFM69  (via drill 0.3)
  Top 0.305: U$1.NSS 27.66,23.85 27.94,24.13 v27.94,24.77 | v27.94,27.3 27.94,32.07 29,33.13 IC1.36
  Bottom 0.305: v27.94,24.77 v27.94,27.3
DIGIT1
  Top 0.305: IC1.16 36.81,49.72 Q10.1
DIGIT2
  Top 0.305: IC1.15 37.31,52.4 Q12.1
DIGIT3
  Top 0.305: IC1.13 38.31,57.75 Q16.1
DIGIT4
  Top 0.305: IC1.14 37.81,55.07 Q14.1
DISABLE
  Top 0.305: IC1.2 40.67,33.63 41.59,32.7
  Top 0.406: R20.2 87.42,49.31 79.06,40.96 58.1,40.96 48.58,31.43 42.86,31.43 41.59,32.7
DP  (via drill 0.3)
  Top 0.813: PAD6.1 v16.83,6.99 18.89,6.99 18.86,7.01 | SEG2.1 66.75,7.06 v66.67,6.99 v68.26,6.99 | R4.2 93.5,6.99 PAD10.1 v92.08,6.99
  Bottom 0.813: 76.92,6.99 v68.26,6.99 v67.47,6.99 v18.73,6.99 | 77.08,6.98 76.92,6.99 | SEG1.1 18.86,7.01 18.76,7.01 v18.73,6.99 | v16.83,6.99 v17.78,6.99 v18.73,6.99 | 76.92,6.99 v92.08,6.99
EN_BOOST
  Top 0.305: IC1.11 43.84,38.13 44.45,38.73 44.45,47.31 45.4,48.26 45.4,50.48 50.48,55.56 50.48,63.82 52.38,65.71 IC2.2
GND  (via drill 0.3)
  Top 0.305: IC1.23 33.31,41.3 32.46,42.15 C1.2 | IC1.44 36.31,32.5 36.51,32.7 37.15,32.7 | 37.15,32.7 37.47,32.7 37.81,32.36 IC1.47 37.81,30.77 38.66,29.92 C2.2 | IC1.8 38.62,36.63 v38.42,36.83 | v37.15,33.34 37.15,32.7
  Top 0.406: R17.1 54.61,71.65 v54.61,71.44 v54.61,68.9 | 92.54,66.36 v90.81,66.36 Q18.E | v62.55,55.88 v62.55,52.07 | v60.01,52.07 v60.01,48.26 60.01,49.23 BAT1.- | v62.55,48.26 v62.55,44.45 | Q16.2 38.73,60.01 38.42,60.33 35.56,60.33 | 35.56,60.33 v32.38,60.33 | v29.21,60.33 Q10.2 | Q12.2 v32.38,60.32 v32.38,60.33 | Q14.2 35.56,60.32 35.56,60.33 | C16.2 R22.2 | R24.2 C17.2 | v32.38,60.33 v29.21,60.33 | v26.04,60.33 v29.21,60.33 | v22.86,60.33 v26.04,60.33 | v19.68,60.33 v22.86,60.33 | v19.68,60.33 v16.51,60.33 Q7.2 | Q8.2 v19.68,60.33 | Q3.2 v22.86,60.33 | Q2.2 v26.04,60.33 | v12.06,66.04 12.06,57.47 v11.75,57.15 | C8.1 C5.1
  Top 0.61: v73.98,66.67 IC4.2 IC4.3 76.7,67.62 C13.2 77.28,67.94 | v66.99,69.22 66.99,68.58 | 66.99,68.58 v66.99,67.94 | v70.8,69.53 C15.1 70.72,68.39 C14.2 67.18,68.39 66.99,68.58 | IC3.2 v60.01,17.14 | v60.01,17.14 v60.01,16.19 | v62.55,18.73 R15.2 61.7,16.83 60.33,16.83 v60.01,17.14 | v61.59,14.61 v61.6,14.6 X1.5 62,13.65 v62.23,13.65 | C1.2 31.67,42.23 v30.8,42.23 | C2.2 40.08,29.84 v40.96,29.84 | C5.1 48.26,32.7 v48.74,33.18 | C6.2 v48.9,36.83 | C12.2 48.74,38.89 v48.9,38.73 | C17.2 48.74,43.02 v48.9,42.86 | R24.2 48.48,44.45 v48.9,44.45 | R22.2 v44.13,52.07 | U$1.GNDA 18.54,22.03 v18.41,21.91 | U$1.GNDB 14.7,22 v14.61,21.91 | L1.1 v13.34,22.23
  Top 0.813: Q4.2 83.04,6.99 Q5.2 80.33,8.89 79.69,9.53 v79.69,11.43 79.69,12.53 Q1.2 83.67,11.43 Q6.2 | C4.- 44.13,71.75 v44.45,71.44 | v51.75,14.92 51.75,15.56 | 51.75,15.56 51.75,18.1 | 51.75,18.1 v51.75,18.73 | C9.2 51.75,18.1 | C10.2 51.75,15.56
  Bottom 0.406: v44.13,52.07 50.16,52.07 50.32,51.91 51.75,51.91 51.91,52.07 v54.93,52.07 | S1.1 41.15,71.25 v41.59,70.8 | S3.1 12.06,69.05 v12.06,66.04
  Bottom 0.61: v48.74,33.18 48.58,33.02 47.31,33.02 | v48.9,38.73 v48.9,36.83 | v8.89,16.19 v7.3,16.19 v5.71,16.19 | v8.89,16.19 v10.48,16.19 v12.06,16.19 12.7,16.83 v12.7,17.46 v14.29,17.46 v15.88,17.46 v17.46,17.46 18.41,18.41 v18.41,18.73 | v18.41,18.73 v18.41,20.32 v18.41,21.91 18.41,22.54 18.1,22.86 14.92,22.86 14.61,22.54 v14.61,20.95 | v12.06,22.54 v12.06,20.95 v14.61,20.95 | v12.06,22.54 v12.06,24.13 v12.06,25.72 v12.06,27.3 v12.06,28.89 v12.06,30.48 v12.06,32.07 v12.06,33.66 v12.06,35.24 v12.06,36.83 v12.06,38.42 v12.06,40.01 v12.06,41.59 v12.06,43.18 v12.06,44.77 v12.06,46.35 v12.06,47.94 v12.06,49.53 v12.06,51.12 v12.06,52.7 v12.06,54.29 v12.06,55.88 12.06,56.83 | 12.06,56.83 v11.75,57.15 v10.16,57.15 v8.57,57.15 v6.99,57.15 v5.4,57.15 v3.81,57.15 v2.22,57.15 v0.95,57.15 | v14.61,20.95 v14.61,21.91 | v13.34,22.23 12.38,22.23 v12.06,22.54 | v0.95,16.19 v2.54,16.19 v4.13,16.19 v5.71,16.19 | v5.71,16.19 v8.89,16.19 | M1.1 18.73,18.41 v18.41,18.73 | 12.06,56.83 15.56,60.33 v16.51,60.33
  Bottom 0.813: v54.93,52.07 v57.47,52.07 v60.01,52.07 v62.55,52.07 67.31,52.07 71.75,56.52 71.75,62.39 73.98,64.61 v73.98,66.67 68.26,66.67 v66.99,67.94 63.69,71.25 S2.1 | v62.55,55.88 v60.01,55.88 v57.47,55.88 v54.93,55.88 54.61,56.2 | v54.93,48.26 v57.47,48.26 v60.01,48.26 v62.55,48.26 72.71,48.26 v90.81,66.36 90.81,68.26 87.82,71.25 S4.1 | v62.23,13.65 61.59,14.29 v61.59,14.61 62.55,15.56 62.55,17.14 | 62.55,17.14 v62.55,18.73 62.55,19.37 62.23,19.68 60.96,19.68 60.01,18.73 v60.01,17.14 v60.01,16.19 | 62.55,17.14 74.93,17.14 v79.69,12.38 v79.69,11.43
  Bottom 1.016: v62.55,44.45 v60.01,44.45 v57.47,44.45 v54.93,44.45 52.39,44.45 | 52.39,44.45 v48.9,44.45 v48.9,42.86 48.26,42.23 v30.8,42.23 30.8,60.01 31.11,60.33 | v19.68,60.33 v16.51,60.33 31.11,60.33 | 39.05,31.43 UART.2 39.05,23.81 41.59,21.27 SWD.3 41.59,18.1 42.23,17.46 v51.75,17.46 | 39.05,31.43 v37.15,33.34 37.15,35.56 v38.42,36.83 v48.9,36.83 | 47.31,33.02 40.64,33.02 39.05,31.43 | v51.75,17.46 v51.75,18.73 | v51.75,17.46 51.75,16.83 | 51.75,16.83 v51.75,16.19 v51.75,14.92 | v51.75,17.46 51.75,40.32 52.7,41.27 52.7,44.13 52.39,44.45 | 51.75,16.83 52.07,17.14 v60.01,17.14 | 31.11,60.33 v32.38,60.33
  Bottom 1.27: 54.61,56.2 v53.66,57.15
  other vias: 54.61,65.09 52.07,64.14 53.02,64.14 53.98,64.14 63.82,62.55 63.82,61.59 63.18,60.64 62.23,60.64 61.28,60.64 60.33,60.64 47.31,70.8 47.94,69.85 48.58,68.9 49.21,67.94 43.5,71.44 45.4,71.44 46.35,71.44 42.55,71.44 59.37,60.33 58.42,59.69 57.47,59.05 56.52,58.42 55.56,57.78 54.61,57.15 53.02,56.52 52.07,56.2 49.53,56.2 48.26,56.2 46.99,56.2 45.72,56.2 44.77,55.56 43.5,55.56 42.23,55.56 40.96,55.56 40.32,56.52 40.32,57.78 40.32,59.05 40.32,60.33 40.32,61.59 40.32,62.87 40.32,64.14 40.96,67.31 41.59,68.26 41.59,69.53 63.82,65.09 62.55,65.09 61.28,65.09 60.01,65.09 59.05,65.72 59.05,66.99 58.42,67.94 28.26,45.72 21.91,51.75 23.81,34.92 22.23,33.34 22.23,29.21 19.37,36.2 19.37,29.53 14.61,26.04 18.73,26.04 53.02,30.16 49.53,26.67 49.53,22.86 53.02,22.86 52.7,52.07 52.7,48.26 52.7,44.45 55.56,42.86 52.7,40.01 30.16,40.96 27.94,41.27 30.48,43.5 33.97,33.02 32.7,34.61 32.7,38.42 38.1,38.42 35.24,36.2 45.4,30.16 30.8,24.13 34.29,20.95 30.8,17.14 34.61,12.38 40.32,15.56 43.18,13.02 49.21,15.88 48.9,12.7 76.52,52.07 76.52,54.61 72.07,51.44 70.8,44.13 77.47,45.72 84.77,49.53 86.36,54.29 90.17,54.29 88.9,45.4 86.04,43.81 72.07,38.1 60.01,39.05 71.44,33.02 77.47,39.05 74.93,28.57 82.23,35.56 93.03,40.01 79.06,25.08 88.9,31.11 86.04,16.83 93.34,20.32 87.31,24.13 79.06,58.1 72.07,58.1 66.99,53.02 66.36,57.15 68.26,60.01 66.99,61.28
  pour Bottom (isolate 0.406): 40.96,70.17 40.96,70.48 42.23,71.75 46.67,71.75 49.21,69.22 57.47,69.22 59.37,67.31 59.37,66.04 60.01,65.41 63.82,65.41 64.14,65.09 64.14,60.96 63.5,60.33 60.01,60.33 54.93,56.83 53.98,56.83 53.02,55.88 45.72,55.88 45.09,55.24 40.64,55.24 39.69,56.2 39.69,66.67 40.96,67.94
  pour Top (isolate 0.406): 40.96,70.17 40.96,70.48 42.23,71.75 46.67,71.75 49.21,69.22 57.47,69.22 59.37,67.31 59.37,66.04 60.01,65.41 63.82,65.41 64.14,65.09 64.14,60.96 63.5,60.33 60.01,60.33 54.93,56.83 53.98,56.83 53.02,55.88 45.72,55.88 45.09,55.24 40.64,55.24 39.69,56.2 39.69,66.67 40.96,67.94
  pour Bottom (isolate 0.406): -0.32,75.56 39.05,75.56 39.05,54.61 65.09,54.61 65.09,75.56 96.84,75.56 97.47,6.35 -0.64,6.35 -1.27,16.51 11.75,16.51 11.75,56.83 -0.32,56.83
  pour Top (isolate 0.406): -0.32,75.56 39.05,75.56 39.05,54.61 65.09,54.61 65.09,75.56 96.84,75.56 96.84,6.35 -1.27,6.35 -1.27,16.51 11.75,16.51 11.75,56.83 -0.32,56.83
MISO
  Top 0.305: IC1.40 34.31,28.28 32.07,26.04 23.5,26.04 22.7,25.24 U$1.MISO
  Top 0.406: M1.7 27.3,19.68 25.72,19.68 24.77,20.64 24.77,21.59 24.13,22.23 23.18,22.23 22.7,22.7 U$1.MISO
MOSI
  Top 0.305: IC1.41 34.81,27.82 32.38,25.4 25.08,25.4 24.7,25.02 U$1.MOSI
  Top 0.406: M1.6 26.04,21.27 24.7,22.61 U$1.MOSI
N$1
  Top 0.813: Q1.3 R1.1
N$2
  Top 0.813: Q2.3 25.4,61.74 R2.1
N$3
  Top 0.813: Q3.3 22.86,62.38 R3.1
N$4
  Top 0.813: Q4.3 89.7,7.94 R4.1
N$5
  Top 0.813: Q5.3 83.65,10.16 86.36,10.16 86.68,9.84 R5.1
N$6
  Top 0.813: Q6.3 R6.1
N$7
  Top 0.813: Q7.3 17.78,63.65 R7.1
N$8
  Top 0.813: Q8.3 20.32,63.01 R8.1
N$9
  Top 0.406: Q9.1 27.31,63.28 R9.2 27.41,62.27 Q10.3
N$10
  Top 0.406: Q11.1 30.48,63.28 R10.2 30.58,62.27 Q12.3
N$11
  Top 0.406: Q13.1 33.66,63.28 R11.2 33.76,62.27 Q14.3
N$12
  Top 0.406: Q15.1 36.83,63.28 R12.2 36.93,62.27 Q16.3
N$13  (via drill 0.3)
  Top 0.305: IC1.21 34.31,42.21 19.68,56.83 14.92,56.83 13.65,58.1 v13.65,62.87
  Bottom 0.305: v13.65,62.87 25.72,62.87 30.16,67.31 30.16,69.85 31.56,71.25 S1.2
N$14
  Top 0.406: C3.1 52.6,69.43 51.97,68.8 51.97,66.78 52.39,66.36 IC2.3 R13.1
N$15
  Top 0.305: IC1.5 40.76,35.13 42.12,33.76 Y1.3 43.45,32.7 C5.2
N$17  (via drill 0.3)
  Top 0.305: IC1.4 38.72,34.63 v38.42,34.92
  Top 0.406: v49.21,34.92 57.15,42.86 64.45,42.86 65.41,43.81 v65.41,62.55
  Bottom 0.305: v38.42,34.92 v49.21,34.92
  Bottom 0.406: S2.2 62.63,66.36 64.14,66.36 65.41,65.09 v65.41,62.55
N$18
  Top 0.305: IC1.22 33.81,41.76 19.37,56.2 14.61,56.2 13.02,57.78 13.02,67.97 S3.2
N$19
  Top 0.305: IC1.6 40.71,35.63 41.59,36.51 43.54,36.51 Y1.1 45.29,34.77 C8.2
N$20
  Top 0.406: IC3.5 62.1,15.53 R15.1
N$21  (via drill 0.3)
  Top 0.406: IC3.1 61.56,18.73 v61.59,18.73 | v52.7,11.43 48.79,7.52 R16.2
  Bottom 0.406: v61.59,18.73 61.59,16.51 58.42,13.34 57.15,13.34 55.24,11.43 v52.7,11.43
N$22
  Top 0.406: R16.1 46.77,6.99 LED.C
N$23
  Top 0.406: C3.2 51.12,69.95 51.12,66.04 50.14,65.06 IC2.8 48.24,65.06 48.1,64.93 47.94,64.77
  Top 0.813: 47.18,62.8 47.18,64.01 48.1,64.93
  Top 1.016: 47.18,62.8 L3.2
  Top 1.27: D1.A 43.07,57.78 46.99,57.78 46.99,59.5 L3.2
N$24
  Top 0.61: U$1.ANT 16.54,21.3 ANT.1 16.51,19.47 C11.1
N$25
  Top 0.61: U$4.ANT 13.34,19.37 | 13.34,19.37 C11.2 | L1.2 13.34,19.37
N$26
  Top 0.406: R14.1 R17.2 53.72,70.84 53.72,67.5 IC2.4
N$27
  Top 0.305: Q17.1 80.38,65.41 83.19,65.41 | 83.19,65.41 Q18.C | D2.A 83.19,65.41
  Top 0.406: Q17.1 79.38,62.97 R19.2
N$28
  Top 0.406: R20.1 90.49,61.91 Q19.B
N$29
  Top 0.305: IC1.12 39.81,48.8 R21.2
  Top 0.406: R21.2 C16.1 R22.1
N$30
  Top 0.406: IC4.4 71.65,67.62 C15.2
N$31
  Top 0.305: IC1.10 44.3,37.63 45.09,38.42 45.09,41.97 C17.1
  Top 0.406: C17.1 R24.1 R23.2
NRF24_CE  (via drill 0.3)
  Top 0.305: v24.77,27.3 24.77,33.34 26.55,35.13 IC1.32
  Bottom 0.305: M1.3 24.77,19.68 v24.77,27.3
NRF24_IRQ  (via drill 0.3)
  Top 0.305: M1.8 27.3,22.23 26.04,22.23 25.72,22.54 v25.72,24.77 | v25.72,27.3 25.72,33.34 27.01,34.63 IC1.33
  Bottom 0.305: v25.72,24.77 v25.72,27.3
NRST  (via drill 0.3)
  Top 0.305: IC1.7 38.67,36.13 v35.88,33.34
  Bottom 0.406: SWD.5 37.78,21.59 37.78,27.3 35.88,29.21 v35.88,33.34
RFM69_DIO0
  Top 0.305: IC1.25 28.68,38.63 26.92,40.39 U$1.DIO0
RFM69_DIO1
  Top 0.305: IC1.26 28.23,38.13 24.77,41.59 24.77,43.47 U$1.DIO1
RFM69_DIO2
  Top 0.305: IC1.27 27.14,37.63 22.7,42.07 U$1.DIO2
RFM69_DIO3
  Top 0.305: IC1.28 25.42,37.13 20.54,42.01 U$1.DIO3
RFM69_DIO4
  Top 0.305: IC1.29 24.02,36.63 18.54,42.1 U$1.DIO4
RFM69_DIO5
  Top 0.305: IC1.30 22.61,36.13 16.54,42.2 U$1.DIO5
RX
  Top 0.305: UART.1 39.69,27.62 38.1,27.62 35.81,29.91 IC1.43
S_A
  Top 0.305: IC1.19 35.31,43.43 20.64,58.1 18.1,58.1 17.78,58.42 Q8.1
S_B
  Top 0.305: IC1.20 34.81,42.66 20,57.47 15.24,57.47 14.61,58.1 Q7.1
S_C  (via drill 0.3)
  Top 0.305: Q5.1 81.12,10.8 v81.12,12.7 | v79.38,14.45 77.79,16.03 77.79,19.68 64.45,33.02 53.98,33.02 48.26,27.3 48.26,19.05 47.62,18.41 40.64,18.41 40.32,18.73 40.32,21.91 39.37,22.86 34.92,22.86 33.97,23.81 33.97,25.4 v33.66,25.72 | IC1.35 32.41,33.63 32.7,33.34 32.7,33.02 31.75,32.07 v31.75,27.62
  Bottom 0.305: v81.12,12.7 v79.38,14.45 | v31.75,27.62 v33.66,25.72
S_D
  Top 0.305: Q6.1 82.87,13.33 82.23,13.97 82.23,14.61 81.92,14.92 80.01,14.92 79.06,15.88 79.06,20.32 65.09,34.29 53.34,34.29 47.31,28.26 38.42,28.26 36.81,29.86 IC1.45
S_DOT  (via drill 0.3)
  Top 0.305: Q4.1 82.55,8.89 82.23,9.21 82.23,11.59 v81.76,12.06 | v78.42,16.51 78.42,20 64.77,33.66 53.66,33.66 49.85,29.84 49.21,29.21 43.81,23.81 35.88,23.81 35.24,24.45 35.24,26.67 v34.92,26.99 | IC1.38 33.31,29.18 v33.02,28.89
  Bottom 0.305: v81.76,12.06 81.76,13.18 v78.42,16.51 | v33.02,28.89 v34.92,26.99
S_E
  Top 0.305: IC1.46 37.31,30.32 38.73,28.89 46.99,28.89 53.02,34.92 65.41,34.92 81.13,19.2 Q1.1
S_F
  Top 0.305: IC1.18 35.81,44.37 Q3.1
S_G
  Top 0.305: IC1.17 36.31,47.05 Q2.1
SCK
  Top 0.305: IC1.39 33.81,28.73 31.75,26.67 22.23,26.67 20.7,25.14 U$1.SCK
  Top 0.406: M1.5 25.72,18.41 24.45,19.68 22.86,19.68 22.23,20.32 22.23,21.59 20.64,23.18 20.64,23.78 U$1.SCK
SEG_A  (via drill 0.3)
  Top 0.61: v21.27,73.98 6.61,73.98 2.48,69.85 PAD13.1 | v22.23,73.98 v21.27,73.98 | v20.32,73.98 v21.27,73.98 | PAD19.1 93.66,69.85 92.71,70.8 92.71,72.56 91.29,73.98 v89.22,73.98 | v21.27,73.98 21.4,73.85
  Top 0.813: v70.17,73.98 v69.22,73.98 | v68.26,73.98 v69.22,73.98 | 21.4,73.85 SEG1.7 20.32,69.97 R8.2 | SEG2.7 69.29,73.91 v69.22,73.98
  Bottom 0.61: v21.27,73.98 v70.17,73.98 v89.22,73.98 v90.17,73.98 v91.12,73.98
SEG_B  (via drill 0.3)
  Top 0.61: v18.73,73.18 7.72,73.18 1.85,67.31 PAD14.1 | PAD20.1 94.3,67.31 88.42,73.18 v86.36,73.18
  Top 0.813: R7.2 17.78,69.97 SEG1.6
  Bottom 0.61: v86.36,73.18 66.67,73.18 | SEG1.6 18.86,73.05 v18.73,73.18 66.67,73.18 | SEG2.6 66.75,73.11 66.67,73.18 | v86.36,73.18 v87.31,73.18 | v88.27,73.18 v86.36,73.18
SEG_C  (via drill 0.3)
  Top 0.813: 21.4,8.12 21.43,8.1 | 21.43,8.1 22.38,8.1 | 21.43,8.1 v20.32,8.1 4.6,8.1 3.17,9.53 PAD5.1 | SEG2.2 69.29,8.17 69.22,8.1 | 69.22,8.1 70.48,8.1 | 69.22,8.1 v68.42,8.1 | R5.2 93.5,9.53 PAD9.1 94.61,8.89 v94.93,8.57
  Bottom 0.813: v21.27,8.1 v20.32,8.1 | SEG1.2 21.4,8.12 21.3,8.12 v21.27,8.1 | v21.27,8.1 v22.23,8.1 v68.42,8.1 v69.37,8.1 v70.33,8.1 93.5,8.1 93.98,8.57 v94.93,8.57
SEG_D  (via drill 0.3)
  Top 0.61: v26.67,9.21 18.1,9.21
  Top 0.813: 18.1,9.21 5.71,9.21 2.86,12.06 PAD4.1 | R6.2 93.5,12.06 PAD8.1 94.61,11.43 v94.93,11.11
  Bottom 0.61: 30.48,9.21 v26.67,9.21 26.48,9.39 SEG1.4 | 66.04,9.21 74.3,9.21 | 74.3,9.21 77.79,9.21 | SEG2.4 74.37,9.28 74.3,9.21
  Bottom 0.813: 66.04,9.21 30.48,9.21 | 77.79,9.21 92.39,9.21 94.3,11.11 v94.93,11.11
SEG_E  (via drill 0.3)
  Top 0.813: SEG1.5 26.95,13.02 18.41,13.02 16.35,10.95 6.99,10.95 3.33,14.61 PAD3.1 | R1.2 93.5,14.61 PAD7.1 94.61,13.97 v94.93,13.65
  Bottom 0.813: SEG1.5 29.65,10.32 55.56,10.32 57.63,12.38 65.41,12.38 66.04,13.02 74.84,13.02 SEG2.5 77.54,10.32 90.96,10.32 94.3,13.65 v94.93,13.65
SEG_F  (via drill 0.3)
  Top 0.61: v78.74,74.77 v79.69,74.77 92.08,74.77 94.46,72.39 PAD18.1 | 26.48,74.64 v26.35,74.77 v25.4,74.77 v24.45,74.77 4.87,74.77 2.48,72.39 PAD12.1
  Top 0.813: 72.89,74.77 v73.03,74.77 v73.98,74.77 | v73.98,74.77 v74.93,74.77 | 26.48,74.64 SEG1.9 22.86,67.43 R3.2 | SEG2.9 74.37,74.38 v73.98,74.77
  Bottom 0.61: v24.45,74.77 v26.35,74.77 v74.93,74.77 v79.69,74.77 v80.64,74.77
SEG_G  (via drill 0.3)
  Top 0.61: v31.11,75.56 4.07,75.56 3.44,74.93 PAD11.1 | PAD17.1 93.98,75.56 v77.79,75.56
  Top 0.813: 29.02,75.56 v29.21,75.56 | v29.21,75.56 v31.11,75.56 | 77.97,75.56 v77.79,75.56 v76.83,75.56 | v76.83,75.56 v75.88,75.56 | v29.21,75.56 29.02,75.38 SEG1.10 25.4,67.43 R2.2 | SEG2.10 76.91,75.49 v76.83,75.56
  Bottom 0.61: v77.79,75.56 v31.11,75.56 | v31.11,75.56 v29.21,75.56 v30.16,75.56 v31.11,75.56
SWCLK  (via drill 0.3)
  Top 0.305: IC1.37 32.81,29.64 32.38,29.21 v32.38,28.26 | v34.29,26.35 34.61,26.04 34.61,24.13 35.4,23.34 41.12,23.34 SWD.2
  Bottom 0.305: v32.38,28.26 v34.29,26.35
SWDIO  (via drill 0.3)
  Top 0.305: IC1.34 30.32,34.13 v30.16,33.97 | v33.02,25.08 33.02,23.97 34.77,22.23 37.15,22.23 SWD.4
  Bottom 0.305: v30.16,33.97 30.16,27.94 v33.02,25.08
SWITCH  (via drill 0.3)
  Top 0.305: IC1.3 38.57,34.13 v38.42,33.97
  Top 0.406: S4.2 83.19,69.8 D2.C 82.34,67.74 v81.6,66.99 | v82.87,62.87 82.87,46.04 78.74,41.91 57.47,41.91 49.53,33.97 v49.21,33.97
  Bottom 0.305: v38.42,33.97 v49.21,33.97
  Bottom 0.406: v81.6,66.99 81.6,64.14 v82.87,62.87
TX
  Top 0.305: IC1.42 35.31,29.46 36.51,28.26 UART.3
V+  (via drill 0.3)
  Top 0.61: C9.1 56.04,18.13 IC3.3 59.06,26.02 BAT1.+
  Top 1.016: R19.1 81.28,62.97 81.28,63.18
  Top 1.27: 81.28,61.28 81.28,63.18 Q17.2
  Top 1.676: 59.2,26.04 BAT1.+
  Top 1.778: v81.28,46.67 81.28,61.28 | 59.2,26.04 v65.09,26.04 v68.9,26.04
  Bottom 0.406: 81.28,48.26 v81.28,47.94
  Bottom 0.61: 81.28,50.16 v81.28,50.48
  Bottom 1.778: 81.28,48.26 v81.28,49.21 81.28,50.16 | 81.28,48.24 v81.28,47.94 v81.28,46.67 81.28,38.73 68.58,26.04 v67.94,26.04 v66.99,26.04 v66.04,26.04 v65.09,26.04
VCC
  Top 0.305: R18.2 85.19,66.04 80.69,66.04 Q17.3 | L3.1 51.12,58.93 51.12,54.93 47.84,51.65 R23.1
  Top 0.406: R13.2 57.68,64.24 58.1,63.82
  Top 0.61: IC4.1 76.7,65.72 C13.1
  Top 1.016: Q17.3 78.28,66.41 C13.1
  Top 1.27: C13.1 75.69,63.82 58.1,63.82 57.94,63.82 C7.+ 52.7,61.91 51.75,60.96 51.75,59.82 L3.1
VDD  (via drill 0.3)
  Top 0.305: C1.1 32.54,40.4 IC1.24 32.46,40.48 31.75,40.48 | IC1.1 39.81,31.87 C2.1 39.96,31.63 IC1.48
  Top 0.406: C14.1 69.82,65.59 v69.85,65.56
  Top 0.61: L2.1 v50.16,40.96 | 31.59,40.48 31.75,40.48 v31.75,39.69
  Top 0.813: IC4.5 72.55,65.59 C14.1 | v51.12,42.23 v51.12,52.7 v51.12,53.66 | v14.92,41.59 14.7,41.81 U$1.VCC | v41.27,31.75 40.08,31.75 C2.1
  Bottom 0.813: 72.07,65.56 v71.75,65.56 v70.8,65.56 v69.85,65.56 69.85,58.74 65.09,53.98 51.44,53.98 v51.12,53.66 v51.12,52.7 | v51.12,43.18 v51.12,42.23 50.16,41.27 v50.16,40.96 50.16,39.69 | 50.16,39.69 v31.75,39.69 20.95,39.69 | 20.95,39.69 16.83,39.69 v14.92,41.59 | SWD.1 46.67,31.75 | 46.67,31.75 48.58,31.75 50.16,33.34 50.16,39.69 | 46.67,31.75 v41.27,31.75 | M1.2 20.95,39.69
VDDA
  Top 0.305: IC1.9 45.84,37.13 C6.1
  Top 0.406: C6.1 C12.1 46.14,40.81 L2.2
VIN
  Top 0.305: 53.98,13.97 54.61,14.61
  Top 0.406: 54.61,14.61 55.56,15.56 C10.1 | 53.98,13.97 48.58,8.57 43.18,8.57 42.11,7.5 LED.A
  Top 0.61: IC3.4 58.42,15.53 | 58.42,15.53 56.04,15.53 C10.1 | X1.1 58.4,15.51 58.42,15.53

### Text on the board
tPlace: BigRedStopwatch | Display V1.1 | 08/17 | github.com/jankae/BigRedStopwatch | - | + | TX | GND | RX | 868MHz | RST | DIO | GND | CLK | VDD